# Altium schematic sheet STM32_Smart.SchDoc
size A3
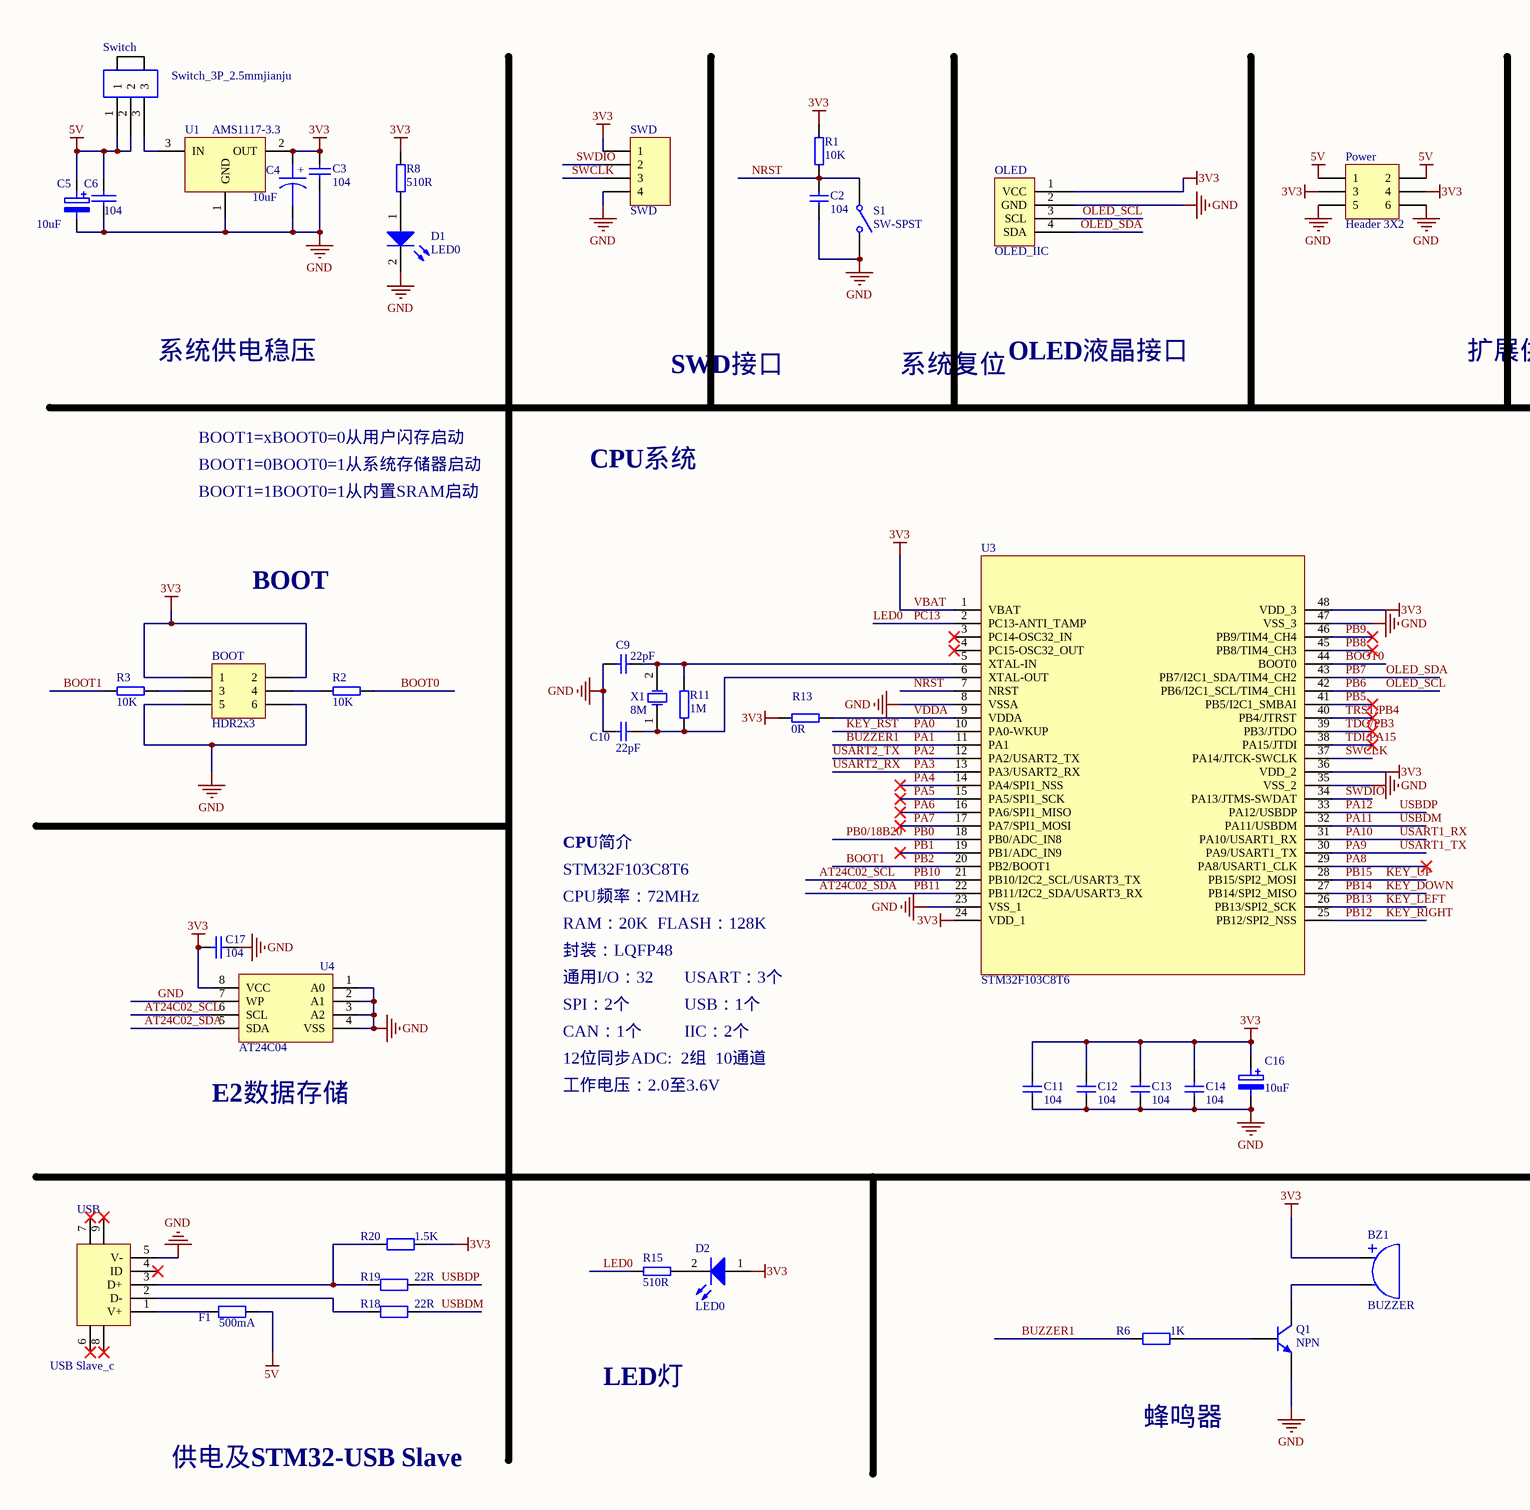
[diagram p0: STM32_Smart.SchDoc, left]
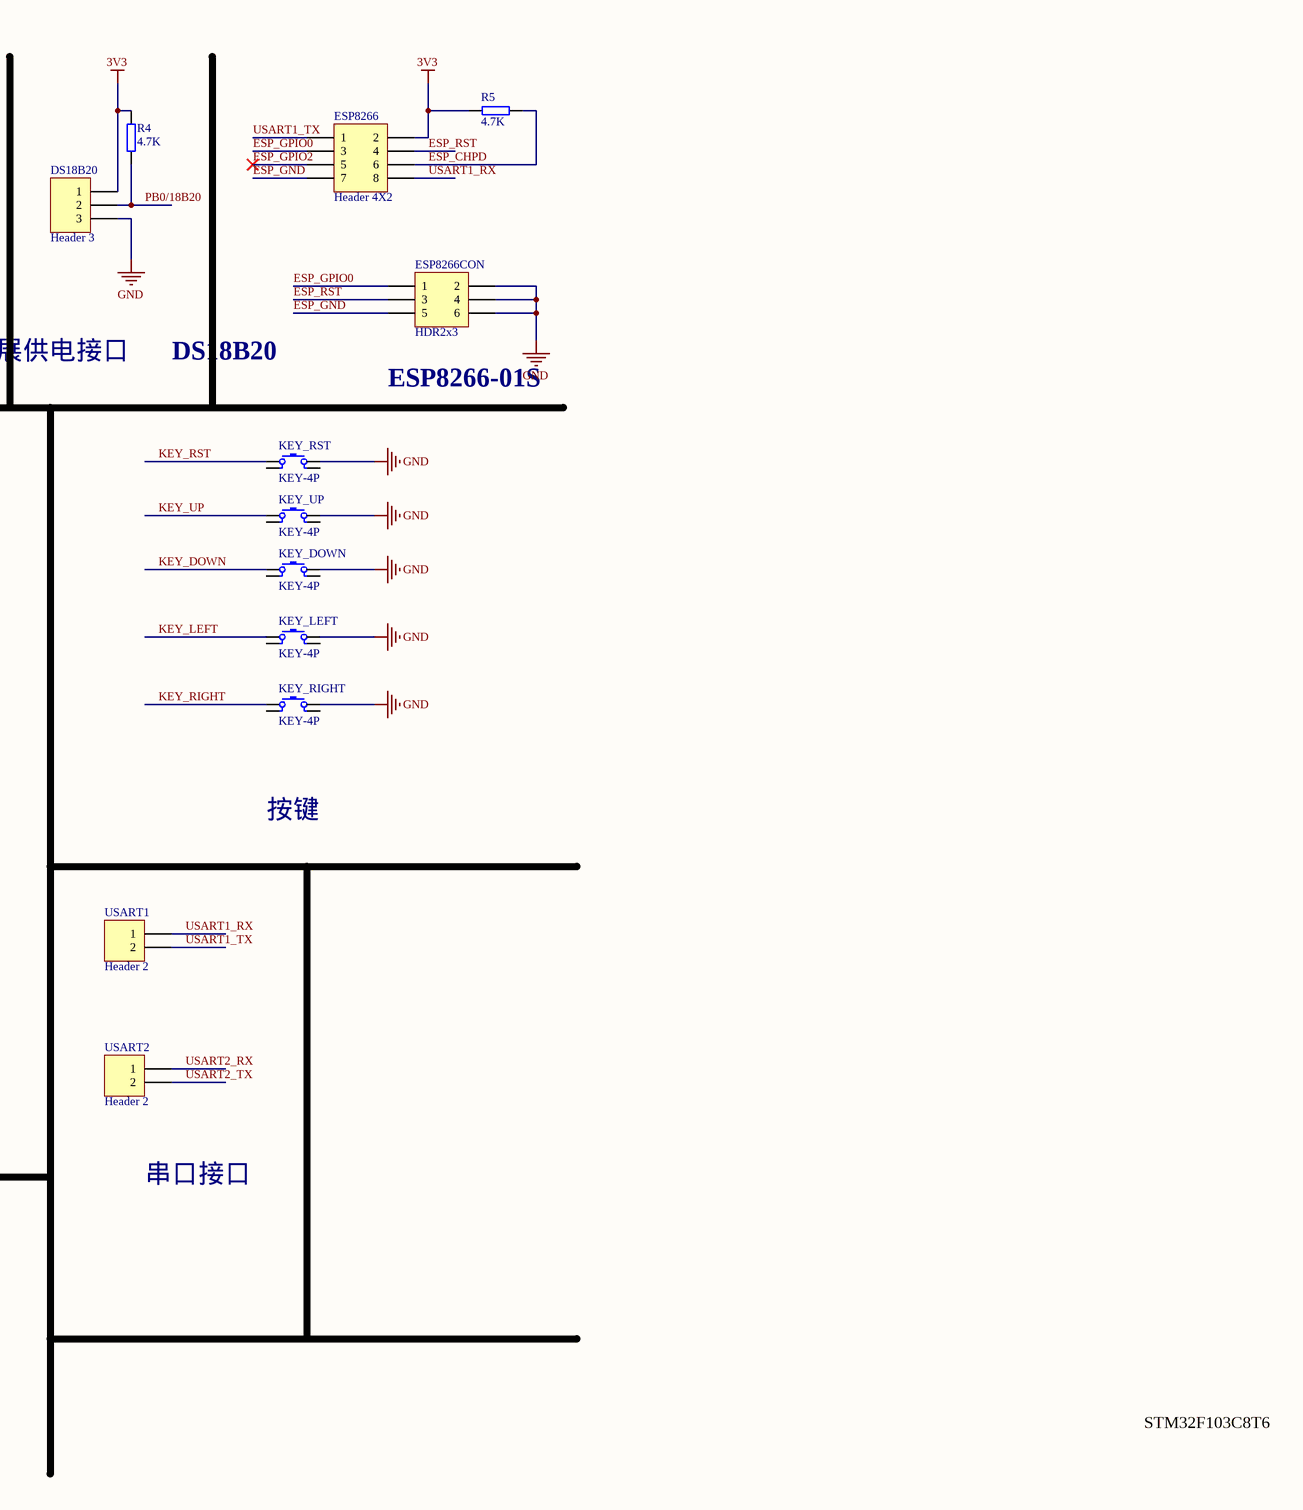
[diagram p1: STM32_Smart.SchDoc, right]

## Parts
BOOT  HDR2x3  [PIN-2x3-2.54-1.0]
BZ1  BUZZER  [BUZZER_12*9.5_pin_7.6mm]
C2  104  [RC0603]
C3  104  [RC0603]
C4  10uF  [RC0805]
C5  10uF  [RC0805]
C6  104  [RC0603]
C9  22pF  [RC0603]
C10  22pF  [RC0603]
C11  104  [RC0603]
C12  104  [RC0603]
C13  104  [RC0603]
C14  104  [RC0603]
C16  10uF  [RC0805]
C17  104  [RC0603]
D1  LED0  [LED0805]
D2  LED0  [LED0805]
DS18B20  Header 3  [HDR1X3]
ESP8266  Header 4X2  [HDR2X4]
ESP8266CON  HDR2x3  [PIN-2x3-2.54-1.0]
F1  500mA  [RC0805]
KEY_DOWN  KEY-4P  [KEY_6.5x4.5]
KEY_LEFT  KEY-4P  [KEY_6.5x4.5]
KEY_RIGHT  KEY-4P  [KEY_6.5x4.5]
KEY_RST  KEY-4P  [KEY_6.5x4.5]
KEY_UP  KEY-4P  [KEY_6.5x4.5]
OLED  OLED_IIC  [OLED_IIC]
Power  Header 3X2  [IDE3X2-2.54]
Q1  NPN  [TO-92]
R1  10K  [RC0603]
R2  10K  [RC0603]
R3  10K  [RC0603]
R4  4.7K  [RC0603]
R5  4.7K  [RC0603]
R6  1K  [RC0603]
R8  510R  [RC0603]
R11  1M  [RC0603]
R13  0R  [RC0603]
R15  510R  [RC0603]
R18  22R  [RC0603]
R19  22R  [RC0603]
R20  1.5K  [RC0603]
S1  SW-SPST  [SMT-KEY]
SWD  SWD  [HDR1X4]
Switch  Switch_3P_2.5mmjianju  [Switch_3p_2.5mmjianju]
U1  AMS1117-3.3  [SOT223]
U3  STM32F103C8T6  [LQFP48]
U4  AT24C04  [SOIC-8P]
USART1  Header 2  [HDR1X2]
USART2  Header 2  [HDR1X2]
USB  USB Slave_c  [MICRO USB CONNECTOR TYPEB-ST-MC-5F-01]
X1  8M  [SMD49S]

## Nets
5V: C5.1 C6.1 F1.1 Power.1 Power.2 Switch.1 Switch.2
GND: BOOT.5 BOOT.6 C2.2 C3.2 C4.2 C5.2 C6.2 C9.2 C10.2 C11.2 C12.2 C13.2 C14.2 C16.2 C17.1 D1.2(K) DS18B20.3 ESP8266CON.2 ESP8266CON.4 ESP8266CON.6 KEY_DOWN.3 KEY_LEFT.3 KEY_RIGHT.3 KEY_RST.3 KEY_UP.3 OLED.2(GND) Power.5 Power.6 Q1.3(E) S1.2(NO) SWD.4 U1.1(GND) U3.8(VSSA) U3.23(VSS_1) U3.35(VSS_2) U3.47(VSS_3) U4.1(A0) U4.2(A1) U4.3(A2) U4.4(VSS) U4.7(WP) USB.5(V-)
VBAT: BOOT.1 BOOT.2 BZ1.1 C3.1 C4.1 C11.1 C12.1 C13.1 C14.1 C16.1 C17.2 D2.1(A) DS18B20.1 ESP8266.2 OLED.1(VCC) Power.3 Power.4 R1.2 R4.1 R5.1 R8.2 R13.2 R20.1 SWD.1 U1.2(OUT) U3.1(VBAT) U3.24(VDD_1) U3.36(VDD_2) U3.48(VDD_3) U4.8(VCC)  [also labelled 3V3]
AT24C02_SCL: U3.21(PB10/I2C2_SCL/USART3_TX) U4.6(SCL)  [also labelled PB10]
AT24C02_SDA: U3.22(PB11/I2C2_SDA/USART3_RX) U4.5(SDA)  [also labelled PB11]
BOOT0: R2.1 U3.44(BOOT0)
BOOT1: R3.2 U3.20(PB2/BOOT1)  [also labelled PB2]
BUZZER1: R6.2 U3.11(PA1)  [also labelled PA1]
ESP_CHPD: ESP8266.6 R5.2
ESP_GND: ESP8266.7 ESP8266CON.5
ESP_GPIO0: ESP8266.3 ESP8266CON.1
ESP_GPIO2: ESP8266.5
ESP_RST: ESP8266.4 ESP8266CON.3
KEY_DOWN: KEY_DOWN.1 U3.27(PB14/SPI2_MISO)  [also labelled PB14]
KEY_LEFT: KEY_LEFT.1 U3.26(PB13/SPI2_SCK)  [also labelled PB13]
KEY_RIGHT: KEY_RIGHT.1 U3.25(PB12/SPI2_NSS)  [also labelled PB12]
KEY_RST: KEY_RST.1 U3.10(PA0-WKUP)  [also labelled PA0]
KEY_UP: KEY_UP.1 U3.28(PB15/SPI2_MOSI)  [also labelled PB15]
LED0: R15.1 U3.2(PC13-ANTI_TAMP)  [also labelled PC13]
NRST: C2.1 R1.1 S1.1(COMMON) U3.7(NRST)
OLED_SCL: OLED.3(SCL) U3.42(PB6/I2C1_SCL/TIM4_CH1)  [also labelled PB6]
OLED_SDA: OLED.4(SDA) U3.43(PB7/I2C1_SDA/TIM4_CH2)  [also labelled PB7]
PA2: U3.12(PA2/USART2_TX) USART2.2  [also labelled USART2_TX]
PA3: U3.13(PA3/USART2_RX) USART2.1  [also labelled USART2_RX]
PA4: U3.14(PA4/SPI1_NSS)
PA5: U3.15(PA5/SPI1_SCK)
PA6: U3.16(PA6/SPI1_MISO)
PA7: U3.17(PA7/SPI1_MOSI)
PA8: U3.29(PA8/USART1_CLK)
PA9: ESP8266.1 U3.30(PA9/USART1_TX) USART1.2  [also labelled USART1_TX]
PA10: ESP8266.8 U3.31(PA10/USART1_RX) USART1.1  [also labelled USART1_RX]
PA11: R18.1 U3.32(PA11/USBDM)  [also labelled USBDM]
PA12: R19.1 U3.33(PA12/USBDP)  [also labelled USBDP]
PB0: DS18B20.2 R4.2 U3.18(PB0/ADC_IN8)  [also labelled PB0/18B20]
PB1: U3.19(PB1/ADC_IN9)
PB5: U3.41(PB5/I2C1_SMBAI)
PB8: U3.45(PB8/TIM4_CH3)
PB9: U3.46(PB9/TIM4_CH4)
SWCLK: SWD.3 U3.37(PA14/JTCK-SWCLK)
SWDIO: SWD.2 U3.34(PA13/JTMS-SWDAT)
TDI/PA15: U3.38(PA15/JTDI)
TDO/PB3: U3.39(PB3/JTDO)
TRST/PB4: U3.40(PB4/JTRST)
VDDA: R13.1 U3.9(VDDA)
NetBOOT_3: BOOT.3 R3.1
NetBOOT_4: BOOT.4 R2.2
NetBZ1_2: BZ1.2 Q1.1(C)
NetC9_1: C9.1 R11.2 U3.5(XTAL-IN) X1.2
NetC10_1: C10.1 R11.1 U3.6(XTAL-OUT) X1.1
NetD1_1: D1.1(A) R8.1
NetD2_2: D2.2(K) R15.2
NetF1_2: F1.2 USB.1(V+)
NetQ1_2: Q1.2(B) R6.1
NetR18_2: R18.2 USB.2(D-)
NetR19_2: R19.2 R20.2 USB.3(D+)
NetSwitch_3: Switch.3 U1.3(IN)

Not connected (* = marked no-connect by the designer): KEY_DOWN 2 4; KEY_LEFT 2 4; KEY_RIGHT 2 4; KEY_RST 2 4; KEY_UP 2 4; U3 3(PC14-OSC32_IN)* 4(PC15-OSC32_OUT)*; USB 4(ID)* 6* 7* 8* 9*

## Notes on the sheet
- 系统供电稳压
- SWD接口
- 系统复位
- OLED液晶接口
- 扩展供电接口
- DS18B20
- ESP8266-01S
- BOOT1=xBOOT0=0从用户闪存启动
- BOOT1=0BOOT0=1从系统存储器启动
- BOOT1=1BOOT0=1从内置SRAM启动
- CPU系统
- BOOT
- CPU简介
- 按键
- STM32F103C8T6
- RAM：20K
- CPU频率：72MHz
- FLASH：128K
- 封装：LQFP48
- 通用I/O：32
- USART：3个
- CAN：1个
- 12位同步ADC:  2组  10通道
- SPI：2个
- USB：1个
- IIC：2个
- (near U4) E2数据存储
- 工作电压：2.0至3.6V
- 串口接口
- LED灯
- 供电及STM32-USB Slave
- 蜂鸣器
- (in symbol CAPACITOR POL) +

## Library data of the parts
BOOT ESP8266CON = HDR2x3: Connector
C2 C11-C14 = CAP1: Capacitor; Tolerate: 50V; Value: 100nF; TOL: 10%; ERP: 0103020075; PCB_Layout: Top Layer SMC; Revision: 2012-3-28; Publisher: ZL_A0OFFICE
C3 C17 = Cap: Capacitor
  C3: Published: 8-Jun-2000; LatestRevisionDate: 17-Jul-2002; LatestRevisionNote: Re-released for DXP Platform.; PackageReference: RAD-0.3; Publisher: Altium Limited
C4 = CAPACITOR POL: Capacitor
C5 C16 = ELECTRO2
C6 = CAP: Capacitor
C9 C10 = CAP1: Capacitor; Tolerate: 50V; Value: 20pF; TOL: 2%; ERP: 0103020090; PCB_Layout: Top Layer SMC; Revision: 2012-3-28; Publisher: ZL_A0OFFICE
D1 D2 = LED0: Typical INFRARED GaAs LED
DS18B20 = Header 3: Header, 3-Pin; LatestRevisionDate: 17-Jul-2002; LatestRevisionNote: Re-released for DXP Platform.; Publisher: Altium Limited
ESP8266 = Header 4X2: Header, 4-Pin, Dual row; LatestRevisionDate: 17-Jul-2002; LatestRevisionNote: Re-released for DXP Platform.; Publisher: Altium Limited
F1 R6 R18-R20 = Res2: Resistor
KEY_DOWN KEY_LEFT KEY_RIGHT KEY_RST KEY_UP = KEY-4P: Key
Power = Header 3X2: Header, 3-Pin, Dual row; LatestRevisionDate: 17-Jul-2002; LatestRevisionNote: Re-released for DXP Platform.; Publisher: Altium Limited
Q1 = NPN: NPN Bipolar Transistor; Published: 8-Jun-2000; LatestRevisionDate: 17-Jul-2002; LatestRevisionNote: Re-released for DXP Platform.; PackageReference: TO-226-AA; Publisher: Altium Limited; PackageDescription: TO, Flat Index; 3 In-Line, Axial Leads; Body Dia. 4.8mm; Leads 0.55 x 0.51 mm (max); Code_JEDEC: TO-226-AA
R1-R5 R8 R11 R13 R15 = R
S1 = SW-SPST: Single-Pole, Single-Throw Switch
SWD = Header 4: Header, 4-Pin; LatestRevisionDate: 17-Jul-2002; LatestRevisionNote: Re-released for DXP Platform.; Publisher: Altium Limited
U1 = LT1085CM-3.3
U4 = EPROM
USART1 USART2 = Header 2: Header, 2-Pin; LatestRevisionDate: 17-Jul-2002; LatestRevisionNote: Re-released for DXP Platform.; Publisher: Altium Limited
USB = MICRO USB CONNECTOR TYPEB: USB Connector
X1 = XTAL_SMD: Crystal Oscillator; ERP: 0103040021; Value: 8MHz; TOL: ±20ppm; Tolerate: ROSON -20_+70 20pf; PCB_Layout: Top Layer SMC; Publisher: ZL_A0OFFICE; Revision: 2012-3-28